# EAGLE design filters_no_gnd_vias (EAGLE 7.1.0)
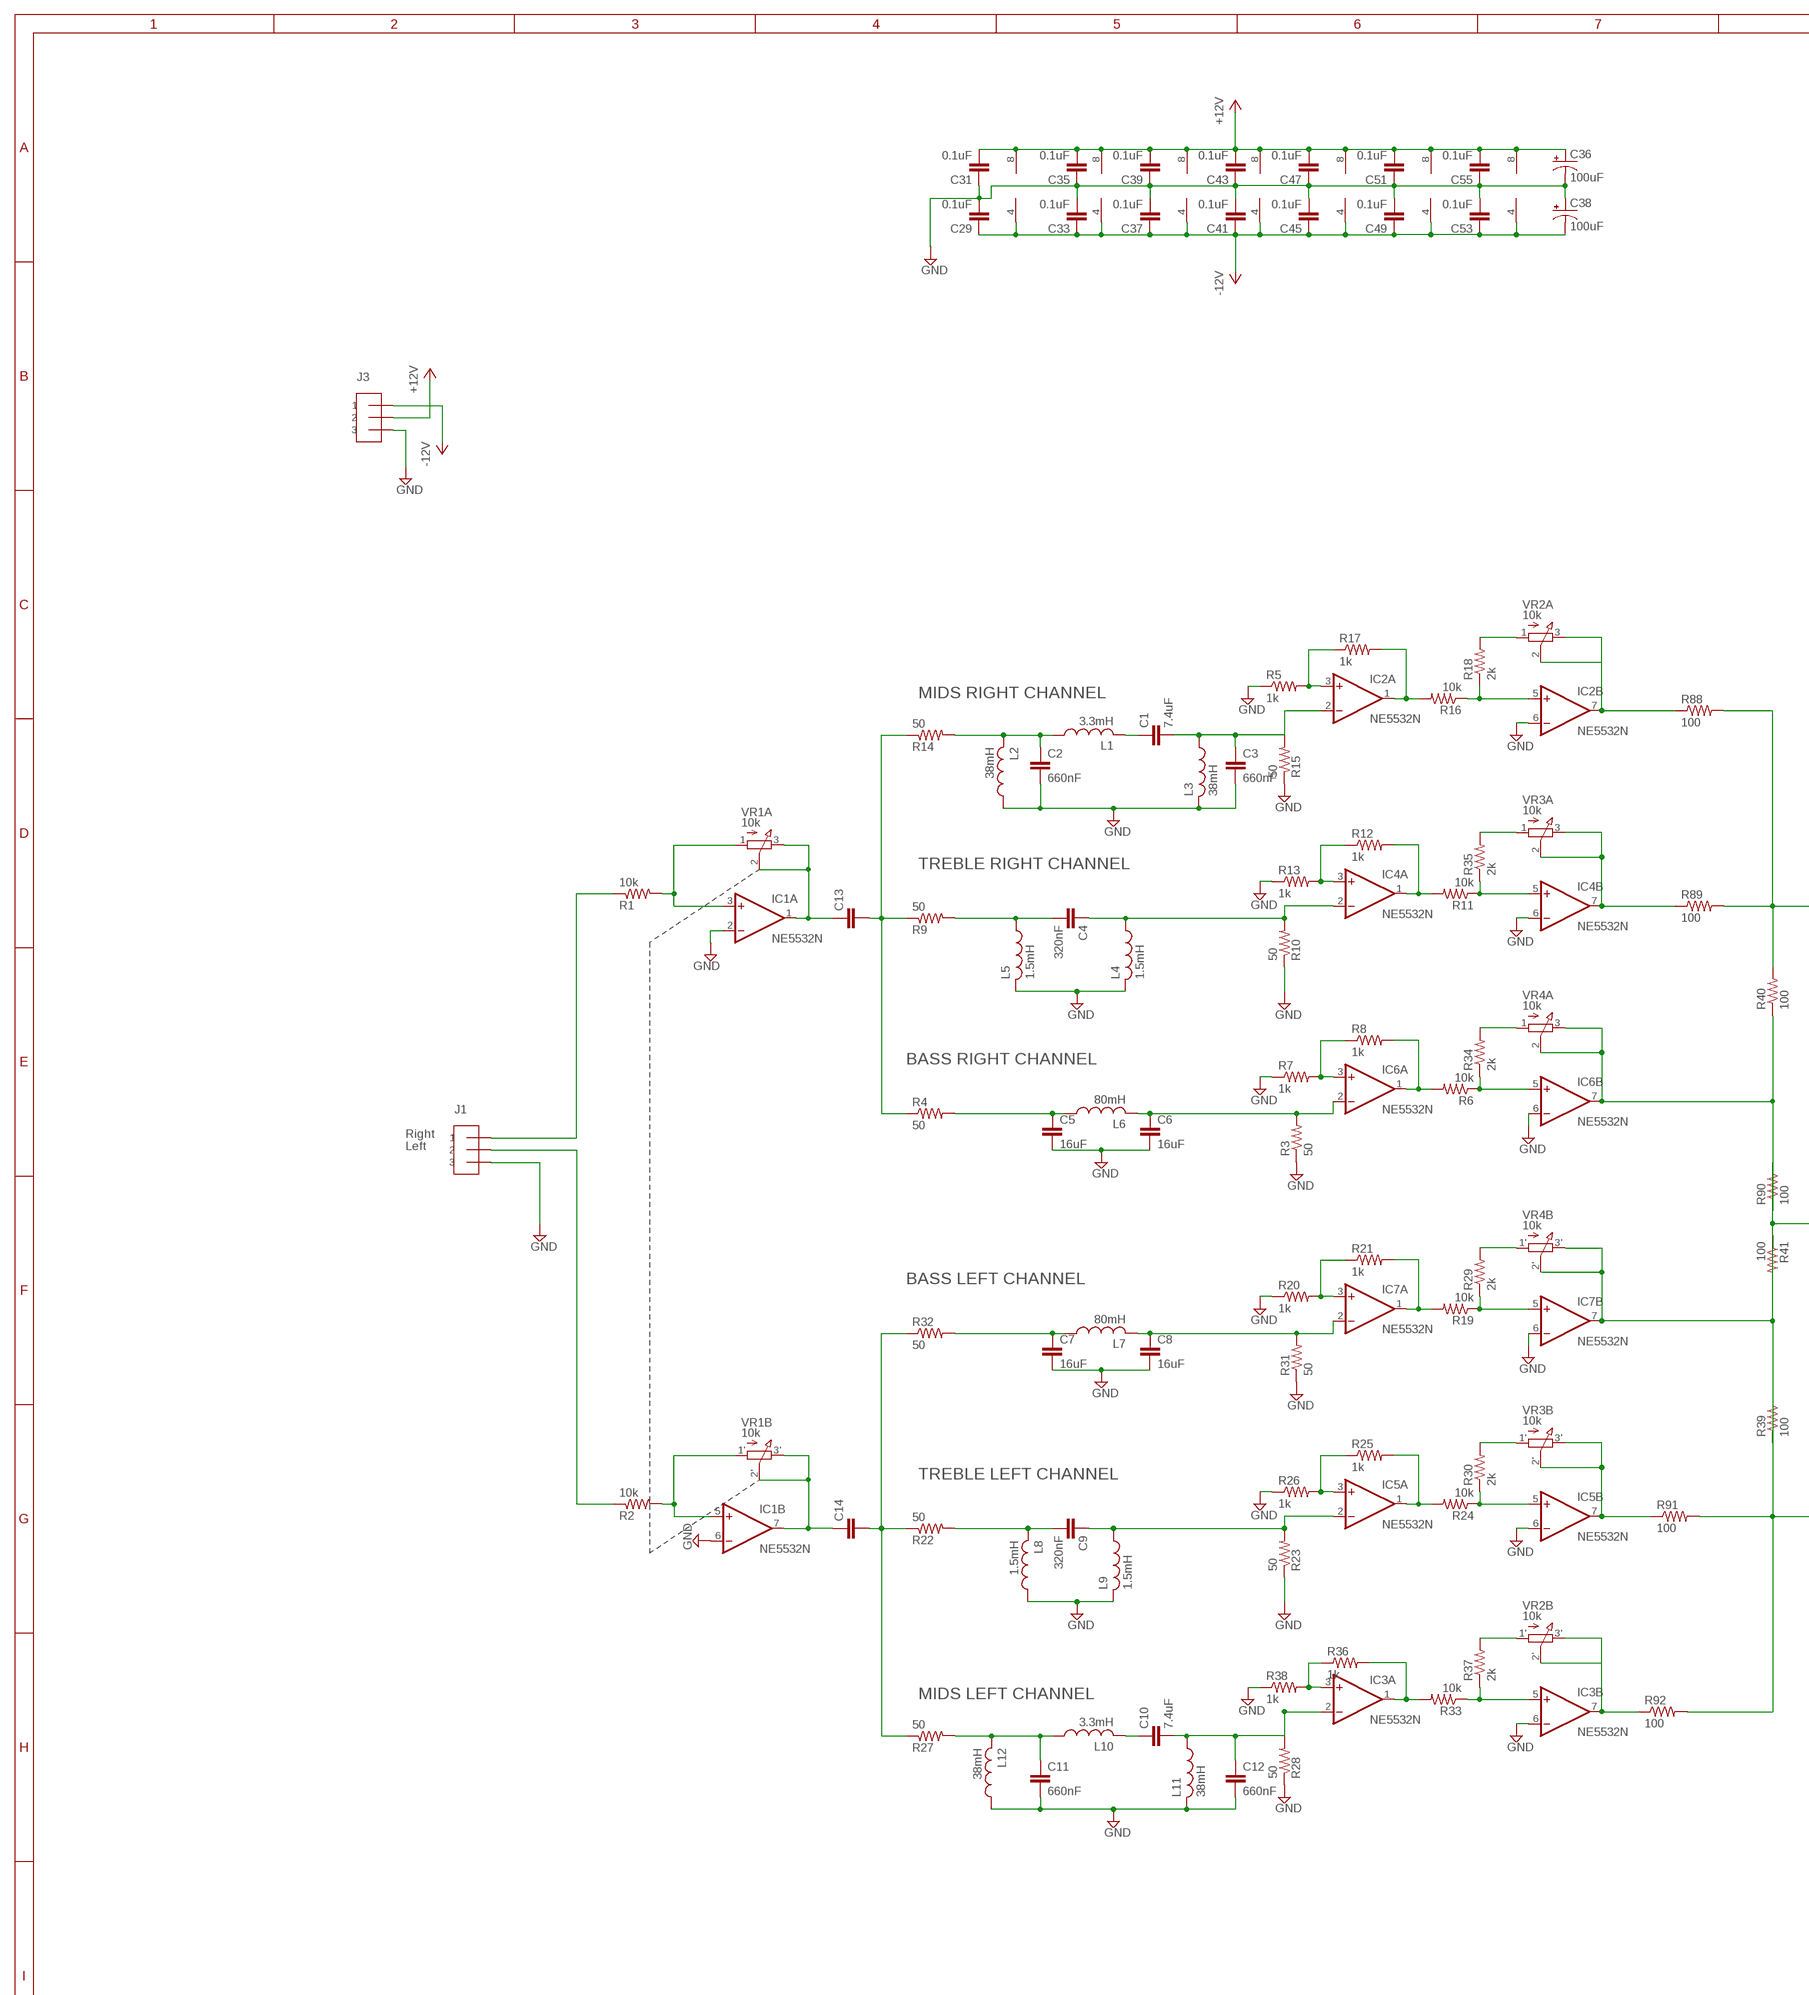
[diagram p0: schematic, sheet 1, part 1 of 2]
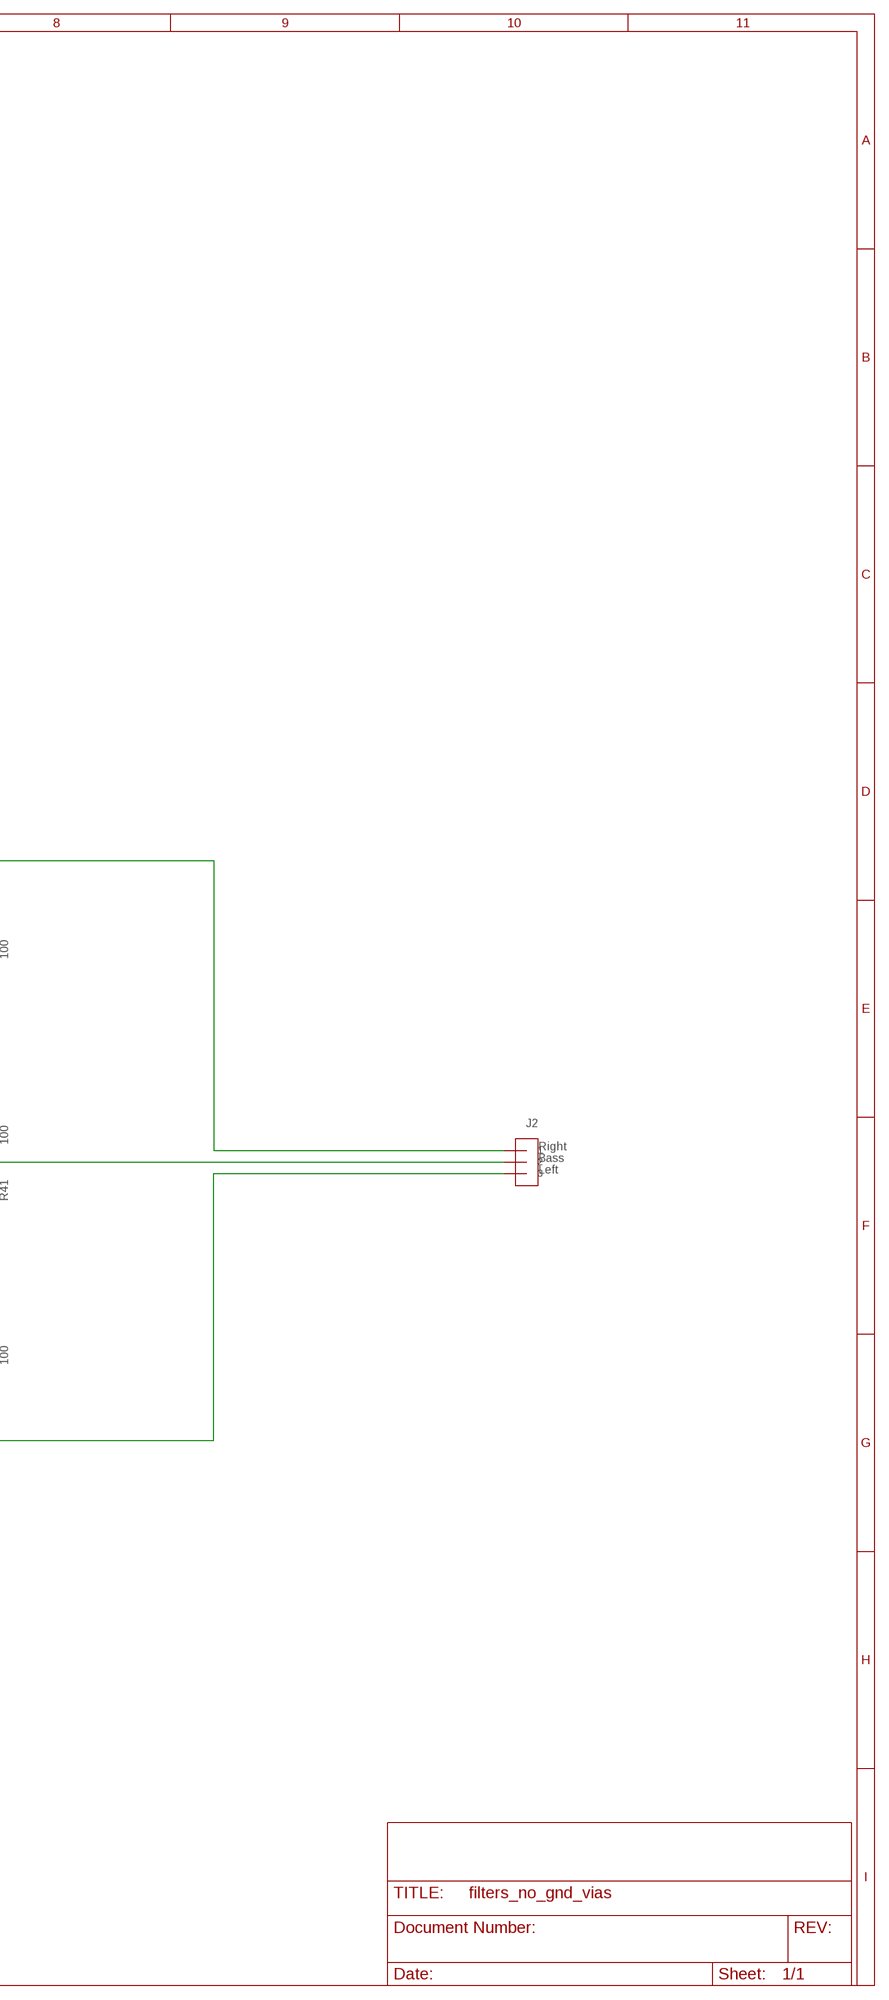
[diagram p1: schematic, sheet 1, part 2 of 2]

## Parts
C1  7.4uF  C-EU025-024X044  [C025-024X044]
C2  660nF  C-EU025-024X044  [C025-024X044]
C3  660nF  C-EU025-024X044  [C025-024X044]
C4  320nF  C-EU025-024X044  [C025-024X044]
C5  16uF  C-EU025-024X044  [C025-024X044]
C6  16uF  C-EU025-024X044  [C025-024X044]
C7  16uF  C-EU025-024X044  [C025-024X044]
C8  16uF  C-EU025-024X044  [C025-024X044]
C9  320nF  C-EU025-024X044  [C025-024X044]
C10  7.4uF  C-EU025-024X044  [C025-024X044]
C11  660nF  C-EU025-024X044  [C025-024X044]
C12  660nF  C-EU025-024X044  [C025-024X044]
C13  C-EU025-024X044  [C025-024X044]
C14  C-EU025-024X044  [C025-024X044]
C29  0.1uF  C-EU025-024X044  [C025-024X044]
C31  0.1uF  C-EU025-024X044  [C025-024X044]
C33  0.1uF  C-EU025-024X044  [C025-024X044]
C35  0.1uF  C-EU025-024X044  [C025-024X044]
C36  100uF  CPOL-USE2.5-6  [E2,5-6]
C37  0.1uF  C-EU025-024X044  [C025-024X044]
C38  100uF  CPOL-USE2.5-6  [E2,5-6]
C39  0.1uF  C-EU025-024X044  [C025-024X044]
C41  0.1uF  C-EU025-024X044  [C025-024X044]
C43  0.1uF  C-EU025-024X044  [C025-024X044]
C45  0.1uF  C-EU025-024X044  [C025-024X044]
C47  0.1uF  C-EU025-024X044  [C025-024X044]
C49  0.1uF  C-EU025-024X044  [C025-024X044]
C51  0.1uF  C-EU025-024X044  [C025-024X044]
C53  0.1uF  C-EU025-024X044  [C025-024X044]
C55  0.1uF  C-EU025-024X044  [C025-024X044]
IC1  NE5532N  [DIL08]
IC2  NE5532N  [DIL08]
IC3  NE5532N  [DIL08]
IC4  NE5532N  [DIL08]
IC5  NE5532N  [DIL08]
IC6  NE5532N  [DIL08]
IC7  NE5532N  [DIL08]
J1  3_PIN_AMPCONN  [3_PIN_AMPCONN]
J2  3_PIN_AMPCONN  [3_PIN_AMPCONN]
J3  3_PIN_AMPCONN  [3_PIN_AMPCONN]
L1  3.3mH  L-US6000-XXX-RC  [6000-XXXX-RC]
L2  38mH  L-US6000-XXX-RC  [6000-XXXX-RC]
L3  38mH  L-US6000-XXX-RC  [6000-XXXX-RC]
L4  1.5mH  L-US6000-XXX-RC  [6000-XXXX-RC]
L5  1.5mH  L-US6000-XXX-RC  [6000-XXXX-RC]
L6  80mH  L-US6000-XXX-RC  [6000-XXXX-RC]
L7  80mH  L-US6000-XXX-RC  [6000-XXXX-RC]
L8  1.5mH  L-US6000-XXX-RC  [6000-XXXX-RC]
L9  1.5mH  L-US6000-XXX-RC  [6000-XXXX-RC]
L10  3.3mH  L-US6000-XXX-RC  [6000-XXXX-RC]
L11  38mH  L-US6000-XXX-RC  [6000-XXXX-RC]
L12  38mH  L-US6000-XXX-RC  [6000-XXXX-RC]
R1  10k  R-US_0204/2V  [0204V]
R2  10k  R-US_0204/2V  [0204V]
R3  50  R-US_0204/2V  [0204V]
R4  50  R-US_0204/2V  [0204V]
R5  1k  R-US_0204/2V  [0204V]
R6  10k  R-US_0204/2V  [0204V]
R7  1k  R-US_0204/2V  [0204V]
R8  1k  R-US_0204/2V  [0204V]
R9  50  R-US_0204/2V  [0204V]
R10  50  R-US_0204/2V  [0204V]
R11  10k  R-US_0204/2V  [0204V]
R12  1k  R-US_0204/2V  [0204V]
R13  1k  R-US_0204/2V  [0204V]
R14  50  R-US_0204/2V  [0204V]
R15  50  R-US_0204/2V  [0204V]
R16  10k  R-US_0204/2V  [0204V]
R17  1k  R-US_0204/2V  [0204V]
R18  2k  R-US_0204/2V  [0204V]
R19  10k  R-US_0204/2V  [0204V]
R20  1k  R-US_0204/2V  [0204V]
R21  1k  R-US_0204/2V  [0204V]
R22  50  R-US_0204/2V  [0204V]
R23  50  R-US_0204/2V  [0204V]
R24  10k  R-US_0204/2V  [0204V]
R25  1k  R-US_0204/2V  [0204V]
R26  1k  R-US_0204/2V  [0204V]
R27  50  R-US_0204/2V  [0204V]
R28  50  R-US_0204/2V  [0204V]
R29  2k  R-US_0204/2V  [0204V]
R30  2k  R-US_0204/2V  [0204V]
R31  50  R-US_0204/2V  [0204V]
R32  50  R-US_0204/2V  [0204V]
R33  10k  R-US_0204/2V  [0204V]
R34  2k  R-US_0204/2V  [0204V]
R35  2k  R-US_0204/2V  [0204V]
R36  1k  R-US_0204/2V  [0204V]
R37  2k  R-US_0204/2V  [0204V]
R38  1k  R-US_0204/2V  [0204V]
R39  100  R-US_0204/2V  [0204V]
R40  100  R-US_0204/2V  [0204V]
R41  100  R-US_0204/2V  [0204V]
R88  100  R-US_0204/2V  [0204V]
R89  100  R-US_0204/2V  [0204V]
R90  100  R-US_0204/2V  [0204V]
R91  100  R-US_0204/2V  [0204V]
R92  100  R-US_0204/2V  [0204V]
VR1  10k  VOL_POT_2GANG  [VOL_POT_2GANG]
VR2  10k  P140KV1-F25BR  [TONE_POT_2GANG]
VR3  10k  P140KV1-F25BR  [TONE_POT_2GANG]
VR4  10k  P140KV1-F25BR  [TONE_POT_2GANG]

## Nets
+12V: C31.2 C35.2 C36.+ C39.2 C43.2 C47.2 C51.2 C55.2 IC1.8(P:V+) IC2.8(P:V+) IC3.8(P:V+) IC4.8(P:V+) IC5.8(P:V+) IC6.8(P:V+) IC7.8(P:V+) J3.2
-12V: C29.1 C33.1 C37.1 C38.- C41.1 C45.1 C49.1 C53.1 IC1.4(P:V-) IC2.4(P:V-) IC3.4(P:V-) IC4.4(P:V-) IC5.4(P:V-) IC6.4(P:V-) IC7.4(P:V-) J3.1
GND: C2.2 C3.2 C5.2 C6.2 C7.2 C8.2 C11.2 C12.2 C29.2 C31.1 C33.2 C35.1 C36.- C37.2 C38.+ C39.1 C41.2 C43.1 C45.2 C47.1 C49.2 C51.1 C53.2 C55.1 IC1.2(A:-IN) IC1.6(B:-IN) IC2.6(B:-IN) IC3.6(B:-IN) IC4.6(B:-IN) IC5.6(B:-IN) IC6.6(B:-IN) IC7.6(B:-IN) J1.3 J3.3 L2.1 L3.2 L4.2 L5.2 L8.1 L9.2 L11.2 L12.1 R3.1 R5.1 R7.1 R10.1 R13.1 R15.1 R20.1 R23.1 R26.1 R28.1 R31.1 R38.1
MVO: IC6.7(B:OUT) R40.1 R90.1 VR4.2(A:1_2) VR4.3(A:1_3)
N$1: IC1.3(A:+IN) R1.2 VR1.1
N$2: C13.1 IC1.1(A:OUT) VR1.2 VR1.3
N$3: IC1.5(B:+IN) R2.2 VR1.1'
N$4: IC2.5(B:+IN) R16.1 R18.1
N$5: C14.1 IC1.7(B:OUT) VR1.2' VR1.3'
N$6: IC6.3(A:+IN) R7.2 R8.1
N$7: C6.1 IC6.2(A:-IN) L6.2 R3.2
N$8: IC3.5(B:+IN) R33.1 R37.1
N$9: IC4.3(A:+IN) R12.1 R13.2
N$10: J2.1 R40.2 R88.2 R89.2
N$11: IC6.5(B:+IN) R6.1 R34.1
N$12: C5.1 L6.1 R4.2
N$13: C4.2 L5.1 R9.2
N$14: C8.1 IC7.2(A:-IN) L7.2 R31.2
N$15: IC2.1(A:OUT) R16.2 R17.2
N$17: IC4.1(A:OUT) R11.2 R12.2
N$18: IC4.5(B:+IN) R11.1 R35.1
N$19: J2.2 R41.2 R90.2
N$21: IC2.7(B:OUT) R88.1 VR2.2(A:1_2) VR2.3(A:1_3)
N$22: C13.2 R4.1 R9.1 R14.1
N$23: C2.1 L1.1 L2.2 R14.2
N$24: R18.2 VR2.1(A:1_1)
N$25: IC7.5(B:+IN) R19.1 R29.1
N$26: J1.1 R1.1
N$27: IC2.3(A:+IN) R5.2 R17.1
N$29: C1.1 L1.2
N$30: C9.2 L8.2 R22.2
N$32: IC5.1(A:OUT) R24.2 R25.2
N$33: IC5.5(B:+IN) R24.1 R30.1
N$34: C11.1 L10.1 L12.2 R27.2
N$35: C10.1 L10.2
N$37: R29.2 VR4.1'(B:1_1)
N$38: J2.3 R39.2 R91.2 R92.2
N$41: IC5.7(B:OUT) R91.1 VR3.2'(B:1_2) VR3.3'(B:1_3)
N$42: R30.2 VR3.1'(B:1_1)
N$43: IC7.1(A:OUT) R19.2 R21.2
N$44: C7.1 L7.1 R32.2
N$45: IC7.3(A:+IN) R20.2 R21.1
N$46: IC5.3(A:+IN) R25.1 R26.2
N$47: IC3.1(A:OUT) R33.2 R36.2
N$50: IC3.7(B:OUT) R92.1 VR2.2'(B:1_2) VR2.3'(B:1_3)
N$53: R34.2 VR4.1(A:1_1)
N$55: IC4.7(B:OUT) R89.1 VR3.2(A:1_2) VR3.3(A:1_3)
N$56: R35.2 VR3.1(A:1_1)
N$57: R37.2 VR2.1'(B:1_1)
N$58: IC3.3(A:+IN) R36.1 R38.2
N$59: C10.2 C12.1 IC3.2(A:-IN) L11.1 R28.2
N$60: C14.2 R22.1 R27.1 R32.1
N$61: C9.1 IC5.2(A:-IN) L9.1 R23.2
N$63: C4.1 IC4.2(A:-IN) L4.1 R10.2
N$64: IC7.7(B:OUT) R39.1 R41.1 VR4.2'(B:1_2) VR4.3'(B:1_3)
N$88: IC6.1(A:OUT) R6.2 R8.2
N$104: C1.2 C3.1 IC2.2(A:-IN) L3.1 R15.2
N$108: J1.2 R2.1

## Notes on the sheet
- MIDS RIGHT CHANNEL
- TREBLE RIGHT CHANNEL
- BASS RIGHT CHANNEL
- Right
- Left
- Right
- Bass
- Left
- BASS LEFT CHANNEL
- TREBLE LEFT CHANNEL
- MIDS LEFT CHANNEL

## Library data of the parts
C1-C14 C29 C31 C33 C35 C37 C39 C41 C43 C45 C47 C49 C51 C53 C55 = rcl:C-EU: CAPACITOR, European symbol
C36 C38 = rcl:CPOL-US: POLARIZED CAPACITOR, American symbol
IC1-IC7 = linear:NE5532: AUDIO AMPLIFIER
J1-J3 = Amplifier_Parts:3_PIN_AMPCONN
L1-L12 = rcl:L-US: INDUCTOR, American symbol
R1-R41 R88-R92 = rcl:R-US_: RESISTOR, American symbol
VR1 = Amplifier_Parts:VOL_POT_2GANG
VR2-VR4 = Amplifier_Parts:P140KV1-F25BR

## Board
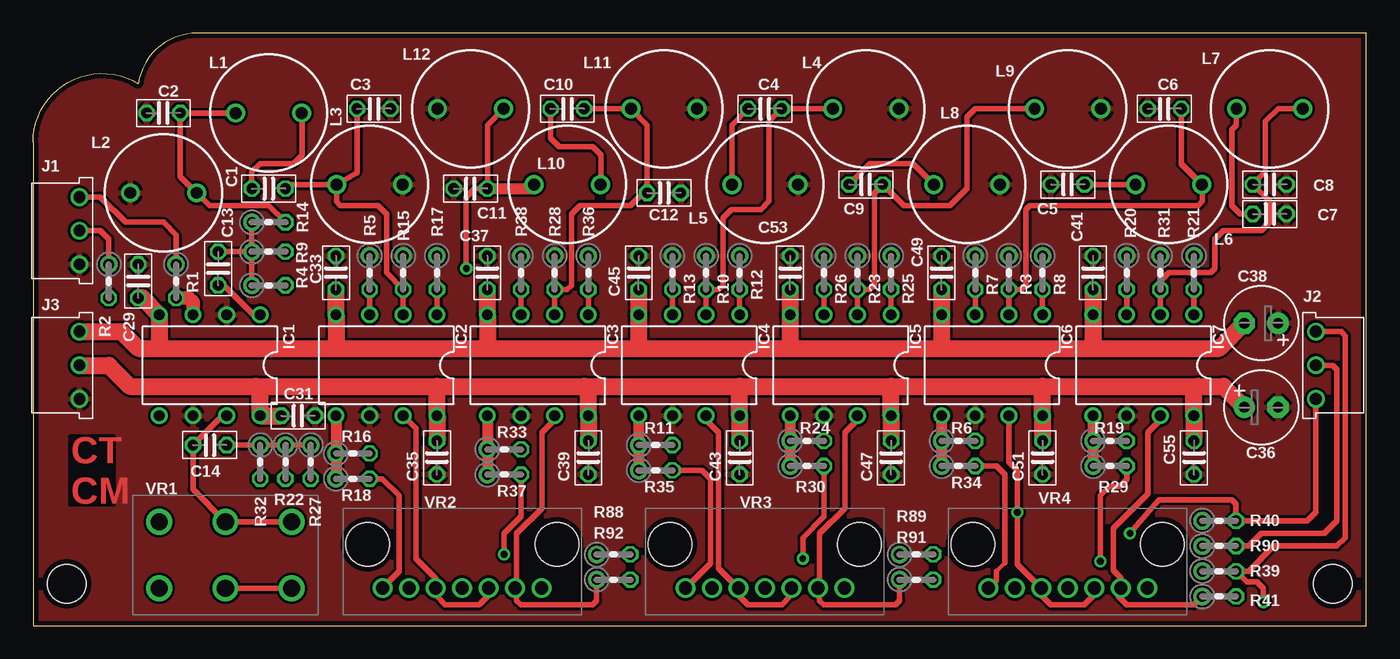
[diagram p2: board, top side]
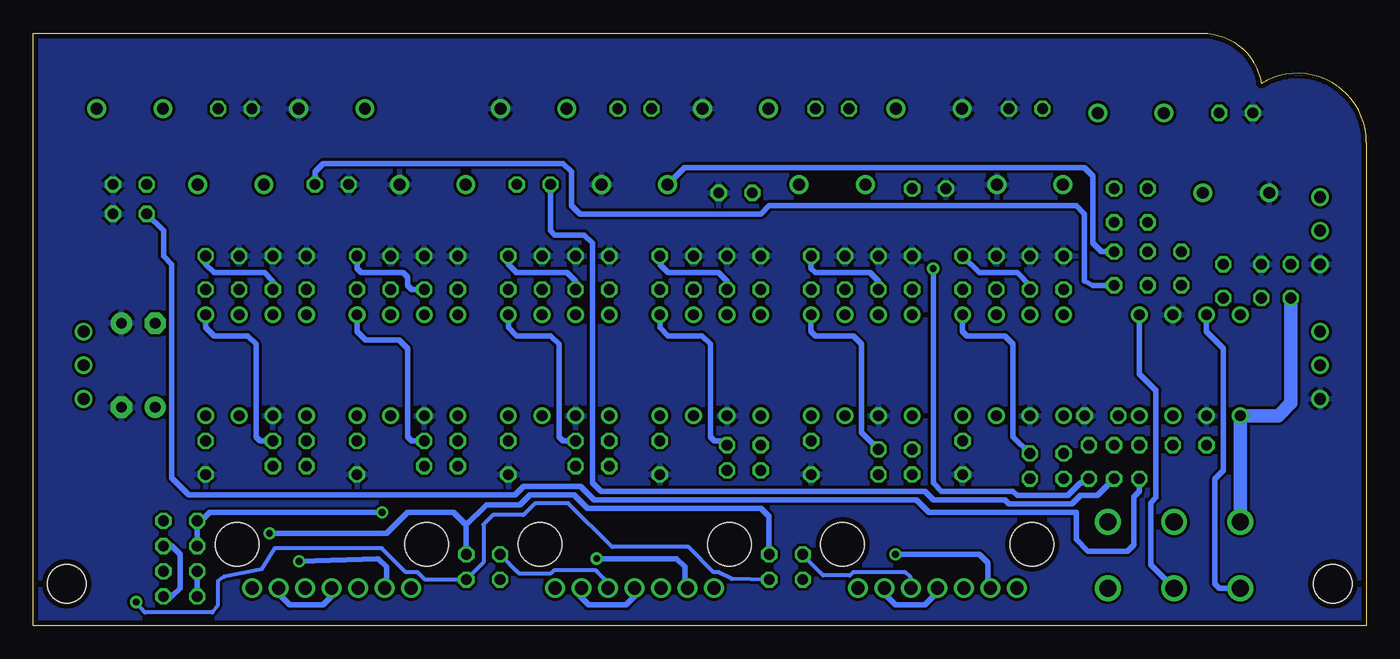
[diagram p3: board, bottom side, seen from below]

Size 100.65 x 44.77 mm. Coordinates in mm from the lower left corner, seen from the top.
Outline: 0,0 100.65,0 100.65,44.77 12.38,44.77 arc81 7.94,40.96 arc122 0,36.51 0,0
Copper layers (1*16): Top 0.0178mm / dielectric 59mil / Bottom 0.0178mm
Design rules "epl-lpkf": minimum track width 8mil, minimum drill 0.35mm, track to track 8mil, track to pad 8mil, pad to pad 8mil, via to via 8mil, smd to smd 8mil, copper to edge 15mil, drill to drill 15mil, minimum pad ring 8mil, minimum via ring 8mil, stop-mask expansion 3mil, vias tented up to drill 0mil, thermal gap 10mil
Holes 2.95 mm at 2.54,3.17 98.11,3.17

### Footprints (pad centres in the part's own frame; a part is rotated, then mirrored left to right if it is on the bottom)
C025-024X044 = drill 0.813 octagon: 1 -1.27,0; 2 1.27,0
E2,5-6 = drill 0.813 pad 1.6: + -1.27,0 | drill 0.813 pad 1.6 octagon: - 1.27,0
DIL08 = drill 0.813 pad 1.27: 1 -3.81,-3.81; 2 -1.27,-3.81; 3 1.27,-3.81; 4 3.81,-3.81; 5 3.81,3.81; 6 1.27,3.81; 7 -1.27,3.81; 8 -3.81,3.81
3_PIN_AMPCONN = drill 0.89: 1 2.54,0; 2 0,0; 3 -2.54,0
6000-XXXX-RC = drill 0.9 pad 1.422: 1 -2.5,0; 2 2.5,0
0204V = drill 0.813 octagon: 1 -1.27,0; 2 1.27,0
VOL_POT_2GANG = drill 1.3: 1 -5,-2; 1' -5,3; 2 0,-2; 2' 0,3; 3 5,-2; 3' 5,3
TONE_POT_2GANG = drill 1: 1 -6,0; 1' -4,0; 2 -2,0; 2' 0,0; 3 2,0; 3' 4,0; NC 6,0 | hole 3.3: -7.15,3.3; 7.15,3.3

### Placement (x,y rotation side)
C1  17.78,33.02 0 top
C2  9.84,38.73 180 top
C3  25.72,39.05 0 top
C4  55.24,39.05 180 top
C5  78.11,33.34 180 top
C6  85.41,39.05 180 top
C7  93.34,31.11 0 top
C8  93.34,33.34 0 top
C9  62.87,33.34 180 top
C10  40.32,39.05 0 top
C11  33.02,33.02 180 top
C12  47.62,32.7 0 top
C13  13.97,26.99 90 top
C14  13.34,13.65 0 top
C29  7.94,26.04 90 top
C31  20,15.88 180 top
C33  22.86,26.67 90 top
C35  30.48,12.7 90 top
C36  92.71,16.51 0 top
C37  34.29,26.67 90 top
C38  92.71,22.86 180 top
C39  41.91,12.7 90 top
C41  80.01,26.67 90 top
C43  53.34,12.7 90 top
C45  45.72,26.67 90 top
C47  64.77,12.7 90 top
C49  68.58,26.67 90 top
C51  76.2,12.7 90 top
C53  57.15,26.67 90 top
C55  87.63,12.7 90 top
IC1  13.34,19.68 180 top
IC2  26.67,19.68 180 top
IC3  38.1,19.68 180 top
IC4  49.53,19.68 180 top
IC5  60.96,19.68 180 top
IC6  72.39,19.68 180 top
IC7  83.82,19.68 180 top
J1  3.49,29.84 90 top
J2  96.84,19.68 270 top
J3  3.49,19.68 90 top
L1  17.78,38.73 0 top
L2  9.84,32.7 0 top
L3  25.4,33.34 0 top
L4  62.87,39.05 0 top
L5  55.24,33.34 0 top
L6  85.72,33.34 0 top
L7  93.34,39.05 0 top
L8  70.48,33.34 180 top
L9  78.11,39.05 0 top
L10  40.32,33.34 0 top
L11  47.62,39.05 0 top
L12  33.02,39.05 0 top
R1  10.79,26.04 270 top
R2  5.71,26.04 270 top
R3  73.66,26.67 270 top
R4  17.78,25.72 0 top
R5  25.4,26.67 270 top
R6  69.85,13.97 0 top
R7  71.12,26.67 270 top
R8  76.2,26.67 270 top
R9  17.78,28.26 0 top
R10  50.8,26.67 270 top
R11  46.99,13.65 0 top
R12  53.34,26.67 270 top
R13  48.26,26.67 270 top
R14  17.78,30.48 0 top
R15  27.94,26.67 270 top
R16  24.13,13.02 0 top
R17  30.48,26.67 270 top
R18  24.13,11.11 0 top
R19  81.28,13.97 0 top
R20  82.55,26.67 270 top
R21  87.63,26.67 270 top
R22  19.05,12.38 270 top
R23  62.23,26.67 270 top
R24  58.42,13.97 0 top
R25  64.77,26.67 270 top
R26  59.69,26.67 270 top
R27  20.95,12.38 270 top
R28  39.37,26.67 270 top
R29  81.28,12.06 0 top
R30  58.42,12.06 0 top
R31  85.09,26.67 270 top
R32  17.14,12.38 270 top
R33  35.56,13.34 0 top
R34  69.85,12.06 0 top
R35  46.99,11.75 0 top
R36  41.91,26.67 270 top
R37  35.56,11.43 0 top
R38  36.83,26.67 270 top
R39  89.53,4.13 0 top
R40  89.53,7.94 0 top
R41  89.53,2.22 0 top
R88  43.81,5.4 0 top
R89  66.67,5.4 0 top
R90  89.53,6.03 0 top
R91  66.67,3.49 0 top
R92  43.81,3.49 0 top
VR1  14.51,4.85 0 top
VR2  32.38,2.86 0 top
VR3  55.24,2.86 0 top
VR4  78.11,2.86 0 top

### Tracks (layer width: path | path; a pad name or v marks a point on that pad's centre or on a via)
+12V
  Top 1.27: J3.2 5.71,19.68 7.3,18.1 16.83,18.1 | 16.83,18.1 30.48,18.1 | 30.48,18.1 41.59,18.1 | 41.59,18.1 53.34,18.1 | 53.34,18.1 64.77,18.1 | 64.77,18.1 76.2,18.1 | 76.2,18.1 87.95,18.1 | 87.95,18.1 89.85,18.1 C36.+ | 30.48,18.1 IC2.8 C35.2 | 41.59,18.1 41.91,17.78 IC3.8 C39.2 | 53.34,18.1 IC4.8 C43.2 | 76.2,18.1 IC6.8 C51.2 | 87.95,18.1 87.63,17.78 IC7.8 C55.2 | 16.83,18.1 17.14,17.78 IC1.8 C31.2 | 64.77,18.1 IC5.8 C47.2
-12V
  Top 1.27: J3.1 6.67,22.23 7.94,20.95 9.21,20.95 | 9.21,20.95 23.18,20.95 | 23.18,20.95 34.29,20.95 | 34.29,20.95 45.72,20.95 | 45.72,20.95 57.47,20.95 | 57.47,20.95 68.58,20.95 | 68.58,20.95 80.01,20.95 | 80.01,20.95 89.53,20.95 C38.- | 23.18,20.95 22.86,21.27 IC2.4 C33.1 | 34.29,20.95 IC3.4 C37.1 | 45.72,20.95 IC4.4 C45.1 | 57.47,20.95 57.15,21.27 IC5.4 C53.1 | 80.01,20.95 IC7.4 C41.1 | 9.21,20.95 9.53,21.27 IC1.4 8.26,24.77 C29.1 | 68.58,20.95 IC6.4 C49.1
GND
  pour Top: 0,0 100.65,0 100.65,44.77 0,44.77
  pour Bottom: 0,0 100.97,-0.32 100.65,44.77 0,44.77
MVO  (via drill 0.51)
  Top 0.406: IC6.7 73.66,12.38 74.3,11.75 v74.3,8.57 74.3,4.67 VR4.2 76.11,2.32 76.83,1.59 79.38,1.59 80.01,2.22 80.01,2.76 VR4.3
  Bottom 0.406: R90.1 R40.1 87.95,7.94 87.31,8.57 v74.3,8.57
N$1
  Top 1.016: R1.2 11.75,24.77 12.06,24.45 IC1.3
  Bottom 0.406: VR1.1 11.1,2.85 11.43,3.17 11.43,11.11 10.79,11.75 10.79,20.95 12.06,22.23 IC1.3
N$2
  Top 0.406: IC1.1 16.64,23.5 14.42,25.72 C13.1 | VR1.2 VR1.3
  Bottom 0.406: VR1.2 16.29,4.62 16.29,9.3 15.89,9.69 15.89,17.79 17.14,19.04 17.14,19.55 17.14,19.56 IC1.1
N$3
  Bottom 1.016: R2.2 5.71,16.83 6.67,15.88 IC1.5 9.53,7.86 VR1.1'
N$4
  Top 0.813: IC2.5 R16.1 R18.1
N$5
  Top 0.406: VR1.3' VR1.2' 12.06,10.3 C14.1 14.29,15.88 IC1.7
N$6
  Top 0.406: R7.2 IC6.3
  Bottom 0.406: R7.2 72.07,25.4 72.39,25.72 72.39,26.35 72.71,26.67 75.88,26.67 76.2,26.99 R8.1
N$7
  Top 0.406: C6.1 86.68,34.88 | 86.68,34.88 L6.2 | IC6.2 R3.2 74.61,25.4 74.93,25.72 74.93,31.43 75.25,31.75 87.95,31.75 88.27,32.07 88.27,33.34 86.72,34.88 86.68,34.88
N$8
  Top 0.813: IC3.5 R33.1 R37.1
N$9
  Top 0.406: R13.2 IC4.3
  Bottom 0.406: R13.2 48.26,26.04 48.9,26.67 52.7,26.67 53.34,27.3 R12.1
N$10  (via drill 0.51)
  Top 0.406: J2.1 96.84,8.57 96.2,7.94 R40.2 90.81,9.21 90.49,9.53 84.96,9.53 v82.8,6.99
  Bottom 0.406: v82.8,6.99 73.98,6.99 72.39,8.57 68.9,8.57 67.94,7.62 | 67.94,7.62 R89.2 | R88.2 45.09,8.26 45.72,8.89 58.8,8.89 59.82,9.91 63.12,9.91 63.88,9.14 66.42,9.14 67.94,7.62
N$11
  Top 0.813: IC6.5 R6.1 R34.1
N$12
  Top 0.406: C5.1 L6.1
  Bottom 0.406: C5.1 79.38,34.29 78.74,34.92 60.64,34.92 60.01,34.29 60.01,31.75 59.37,31.11 45.72,31.11 45.09,31.75 21.91,31.75 21.27,31.11 21.27,26.04 20.64,25.72 R4.2
N$13
  Top 0.406: C4.2 52.74,37.82 L5.1
  Bottom 0.406: L5.1 51.48,34.61 21.27,34.61 20.64,33.97 20.64,28.89 20,28.26 R9.2
N$14
  Top 0.406: L7.2 93.98,39.05 93.03,38.1 93.03,34.29 C8.1 93.34,32.07 93.34,30.48 92.71,29.84 89.85,29.84 89.22,29.21 89.22,26.99 88.9,26.67 85.72,26.67 85.09,26.04 R31.2 IC7.2
N$15
  Top 0.406: R17.2 IC2.1
  Bottom 0.406: IC2.1 30.48,22.23 30.16,21.91 27.3,21.91 26.67,21.27 26.67,14.29 R16.2
N$17
  Top 0.406: R12.2 IC4.1
  Bottom 0.406: IC4.1 53.34,22.54 52.7,21.91 50.16,21.91 49.53,21.27 49.53,14.29 49.21,13.97 48.58,13.97 R11.2
N$18
  Top 0.813: IC4.5 R11.1 R35.1
N$19
  Top 0.406: R90.2 91.76,6.03 92.71,6.99 97.47,6.99 98.42,7.94 98.42,19.37 98.11,19.68 J2.2
  Bottom 0.406: R90.2 90.17,6.03 89.53,5.4 89.53,2.86 90.17,2.22 R41.2
N$21
  Top 0.406: VR2.3 34.29,2.76 34.29,2.22 33.66,1.59 31.11,1.59 30.48,2.22 30.48,2.95 VR2.2 30.39,3.59 28.89,5.08 28.89,14.92 IC2.7
  Bottom 0.305: VR2.3 34.38,3.65 34.8,4.06 38.73,4.06 38.99,3.81 41.02,3.81 42.55,5.33 R88.1
N$22
  Top 0.406: C13.2 R9.1 | R9.1 R14.1 | R9.1 R4.1
N$23
  Top 0.406: L1.1 C2.1 11.11,33.93 L2.2 13.31,31.73 17.8,31.73 R14.2
N$24
  Top 0.406: R18.2 26.35,11.11 27.62,9.84 27.62,4.13 26.39,2.89 VR2.1
N$25
  Top 0.813: IC7.5 R19.1 R29.1
N$26
  Top 0.406: J1.1 5.08,32.38 6.99,30.48 9.84,30.48 10.79,29.53 R1.1
N$27
  Top 0.406: R5.2 IC2.3
  Bottom 0.406: R5.2 25.4,25.72 26.35,26.67 29.21,26.67 R17.1
N$29
  Top 0.406: C1.1 16.51,34.29 17.14,34.92 19.68,34.92 20.32,35.56 20.32,38.7
  Top 0.813: 20.32,38.7 L1.2
N$30
  Top 0.406: L8.2 66.4,34.92 63.18,34.92 C9.2
  Bottom 0.406: C9.2 61.59,29.84 61.28,29.53 59.05,29.53 58.42,28.89 58.42,10.79 57.78,10.16 33.34,10.16 32.7,9.53 27.3,9.53 26.99,9.21 22.23,9.21 21.59,9.84 20.32,9.84 R22.2
N$32
  Top 0.406: R25.2 IC5.1
  Bottom 0.406: IC5.1 64.77,22.54 64.14,21.91 61.59,21.91 60.96,21.27 60.96,14.29 60.64,13.97 R24.2
N$33
  Top 0.813: IC5.5 R24.1 R30.1
N$34  (via drill 0.51)
  Top 0.406: L12.2 34.29,37.82 C11.1 33.34,33.02 32.7,32.38 v32.7,26.99
  Top 0.813: C11.1 37.51,33.02 L10.1
  Bottom 0.406: v32.7,26.99 32.7,10.79 32.07,10.16 26.67,10.16 26.35,9.84 22.54,9.84 21.59,10.79 21.27,10.79 R27.2
N$35
  Top 0.406: C10.1 39.05,36.83 39.69,36.2 42.23,36.2 42.86,35.56 42.86,33.38 L10.2
N$37  (via drill 0.51)
  Top 0.406: v80.57,4.87 80.58,9.84 81.28,10.54 82.04,10.54 82.55,11.05 R29.2
  Bottom 0.406: v80.57,4.87 74.61,5.08 73.98,4.45 73.98,2.98 VR4.1'
N$38  (via drill 0.51)
  Top 0.406: J2.3 98.74,22.23 99.06,21.91 99.06,6.67 98.42,6.03 93.66,6.03 91.76,4.13 R39.2 91.61,3.32 92.38,3.32 92.87,2.84 v92.87,1.8
  Bottom 0.305: R92.2 47.9,3.55 48.9,4.06 49.28,4.06 51.18,5.97 56.95,5.97 60.25,9.27 62.74,9.27 63.63,8.38 65.94,8.38 66.65,7.67 66.65,4.79 R91.2 71.06,3.49 71.63,4.06 72.52,4.06 74.32,5.87 82.4,5.87 83.39,4.28 86.26,3.69 86.71,3.38 86.71,1.56 87.12,1.02 92.21,1.02 v92.87,1.8
N$41
  Top 0.406: IC5.7 62.23,15.56 61.28,14.61 61.28,8.89 59.37,6.99 59.37,2.98 | 59.37,2.98 VR3.3' | 59.37,2.98 59.37,1.91 59.69,1.59 65.09,1.59 65.41,1.91 R91.1
  Bottom 0.406: VR3.2' 55.24,2.22 55.88,1.59 58.74,1.59 59.37,2.22 59.37,2.73 VR3.3'
N$42  (via drill 0.51)
  Top 0.406: R30.2 59.69,8.26 58.1,6.67 v58.1,5.08
  Bottom 0.406: v58.1,5.08 52.07,5.08 51.44,4.45 51.44,3.05 VR3.1'
N$43
  Top 0.406: R21.2 IC7.1
  Bottom 0.406: IC7.1 87.63,22.54 87,21.91 84.45,21.91 83.82,21.27 83.82,14.29 83.5,13.97 R19.2
N$44
  Top 0.406: L7.1 90.84,37.82 90.49,37.47 90.49,31.75 91.12,31.11 C7.1
  Bottom 0.406: C7.1 90.81,29.84 90.81,27.94 90.17,27.3 90.17,11.18 88.9,9.91 64.26,9.91 63.63,10.54 59.31,10.54 58.29,9.53 33.97,9.53 33.02,8.57 21.91,8.57 21.91,6.53 21.02,5.63 18.04,5.63 17.55,6.13 17.55,9.76 17.14,10.16 R32.2
N$45
  Top 0.406: R20.2 IC7.3
  Bottom 0.406: R20.2 82.55,26.04 83.19,26.67 87,26.67 87.63,27.3 R21.1
N$46
  Top 0.406: R26.2 IC5.3
  Bottom 0.406: R26.2 59.69,26.04 60.33,26.67 64.14,26.67 64.77,27.3 R25.1
N$47
  Top 0.406: R36.2 IC3.1
  Bottom 0.406: IC3.1 41.91,22.23 41.59,21.91 38.73,21.91 38.1,21.27 38.1,14.61 R33.2
N$50
  Top 0.406: IC3.7 39.37,15.56 38.42,14.61 38.42,8.89 36.51,6.99 36.51,2.98 | 36.51,2.98 VR2.3' | 36.51,2.98 36.51,1.91 36.83,1.59 42.23,1.59 42.55,1.91 R92.1
  Bottom 0.406: VR2.2' 32.38,2.54 33.34,1.59 35.56,1.59 36.2,2.22 36.2,2.67 VR2.3'
N$53
  Top 0.305: 73.34,4.76 72.71,4.13
  Top 0.406: R34.2 72.71,12.06 73.34,11.43 73.34,4.76 | 72.71,4.13 72.71,3.46 VR4.1
N$55
  Top 0.406: IC4.7 50.8,15.56 51.75,14.61 51.75,4.35 VR3.2 53.24,2.32 53.98,1.59 56.52,1.59 57.15,2.22 57.15,2.76 VR3.3
  Bottom 0.305: R89.1 64.14,4.13 63.94,3.94 61.59,3.94 61.34,4.19 58.17,4.19 58.1,4.13 57.47,3.49 57.47,3.08 VR3.3
N$56
  Top 0.406: R35.2 50.48,11.75 51.12,11.11 51.12,4.73 VR3.1
N$57  (via drill 0.51)
  Top 0.406: R37.2 36.83,8.26 35.56,6.99 v35.56,5.4
  Bottom 0.406: v35.56,5.4 29.21,5.4 28.57,4.76 28.57,3.05 VR2.1'
N$58
  Top 0.406: R38.2 IC3.3
  Bottom 0.406: R38.2 36.83,26.04 37.47,26.67 41.59,26.67 41.91,26.99 R36.1
N$59
  Top 0.406: C10.2 L11.1 46.35,37.82 C12.1 46.04,32.7 45.09,31.75 41.27,31.75 40.64,31.11 40.64,25.72 40.32,25.4 R28.2 IC3.2
N$60
  Top 0.406: C14.2 R32.1 R27.1 R22.1
N$61
  Top 0.406: L9.1 71.12,39.05 70.48,38.42 70.48,33.02 69.22,31.75 65.72,31.75 C9.1 63.5,32.7 63.5,25.72 63.18,25.4 R23.2 IC5.2
N$63
  Top 0.406: L4.1 C4.1 55.56,38.1 55.56,32.07 54.93,31.43 52.7,31.43 52.07,30.8 52.07,25.72 51.75,25.4 R10.2 IC4.2
N$64
  Top 0.406: IC7.7 85.09,15.56 84.14,14.61 84.14,9.97 81.53,7.37 81.53,4.19 82.11,3.62 VR4.3' | 82.23,2.98 VR4.3' | R41.1 87.63,1.59 82.55,1.59 81.92,2.22 81.92,2.67 VR4.3'
  Bottom 0.406: VR4.2' 78.11,2.22 78.74,1.59 81.28,1.59 81.92,2.22 81.92,2.67 VR4.3' | R39.1 R41.1
N$88
  Top 0.406: R8.2 IC6.1
  Bottom 0.406: IC6.1 76.2,22.23 75.56,21.59 73.03,21.59 72.39,20.95 72.39,14.29 72.07,13.97 R6.2
N$104
  Top 0.406: C3.1 24.45,34.25 L3.1 | IC2.2 R15.2 26.67,26.67 26.67,31.11 26.04,31.75 23.18,31.75 22.9,32.03 L3.1 | C1.2 19.37,33.34 L3.1
N$108
  Top 0.406: J1.2 5.08,29.84 5.71,29.21 R2.1

### Text on the board
Top: CT / CM